# Altium schematic sheet switching and switch sensing.SchDoc
size A; SheetNumber: 5; SheetTotal: 5
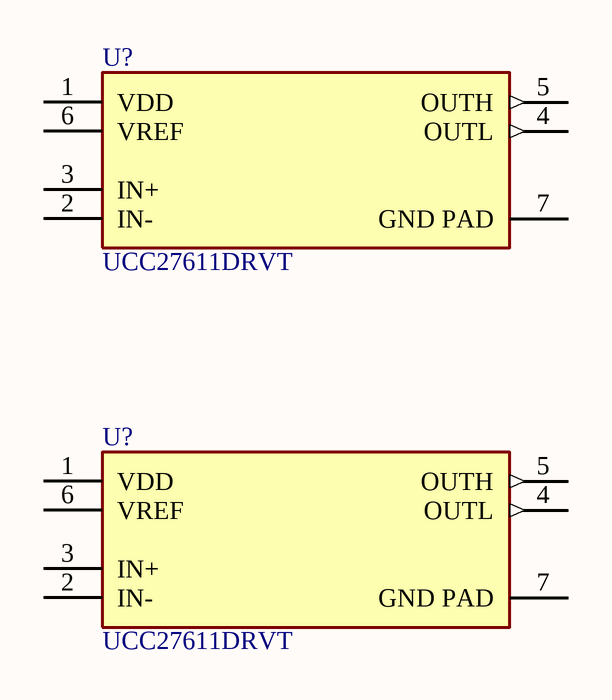
[diagram p0: switching and switch sensing.SchDoc]

## Parts
(Parts that share a designator on the sheet are numbered #1, #2 ... from top to bottom, then left to right.)
U?#1  UCC27611DRVT  [FP-DRV0006A-IPC_A]
U?#2  UCC27611DRVT  [FP-DRV0006A-IPC_A]

## Nets

Not connected (* = marked no-connect by the designer): U?#1 1(VDD) 2(IN-) 3(IN+) 4(OUTL) 5(OUTH) 6(VREF) 7(GND_PAD); U?#2 1(VDD) 2(IN-) 3(IN+) 4(OUTL) 5(OUTH) 6(VREF) 7(GND_PAD)

## Library data of the parts
U?#1 U?#2 = CMP-04912-000043-1: IC GATE DRVR LOW-SIDE 6WSON; Turn-On Delay Time: 25ns; Fall Time: 5ns; Output Current: 6A; Number of Outputs: 2; Number of Channels: 1; Min Supply Voltage: 4V; Max Supply Voltage: 18V; Min Operating Temperature: -40°C; Height: 0.75mm; Case/Package: SON; Max Operating Temperature: 140°C; Length: 2.1mm; Mount: Surface Mount; Series: -; Packaging: Tape and Reel; Lead Free: Lead Free; Turn-Off Delay Time: 25ns; Weight: 0.000342oz; Rise Time: 5ns; REACH SVHC: No SVHC; Propagation Delay: 25ns; Number of Pins: 6; Number of Drivers: 1; Radiation Hardening: No; Width: 2.1mm; Package Quantity: 1; RoHS Compliant: Yes; Max Output Current: 6A